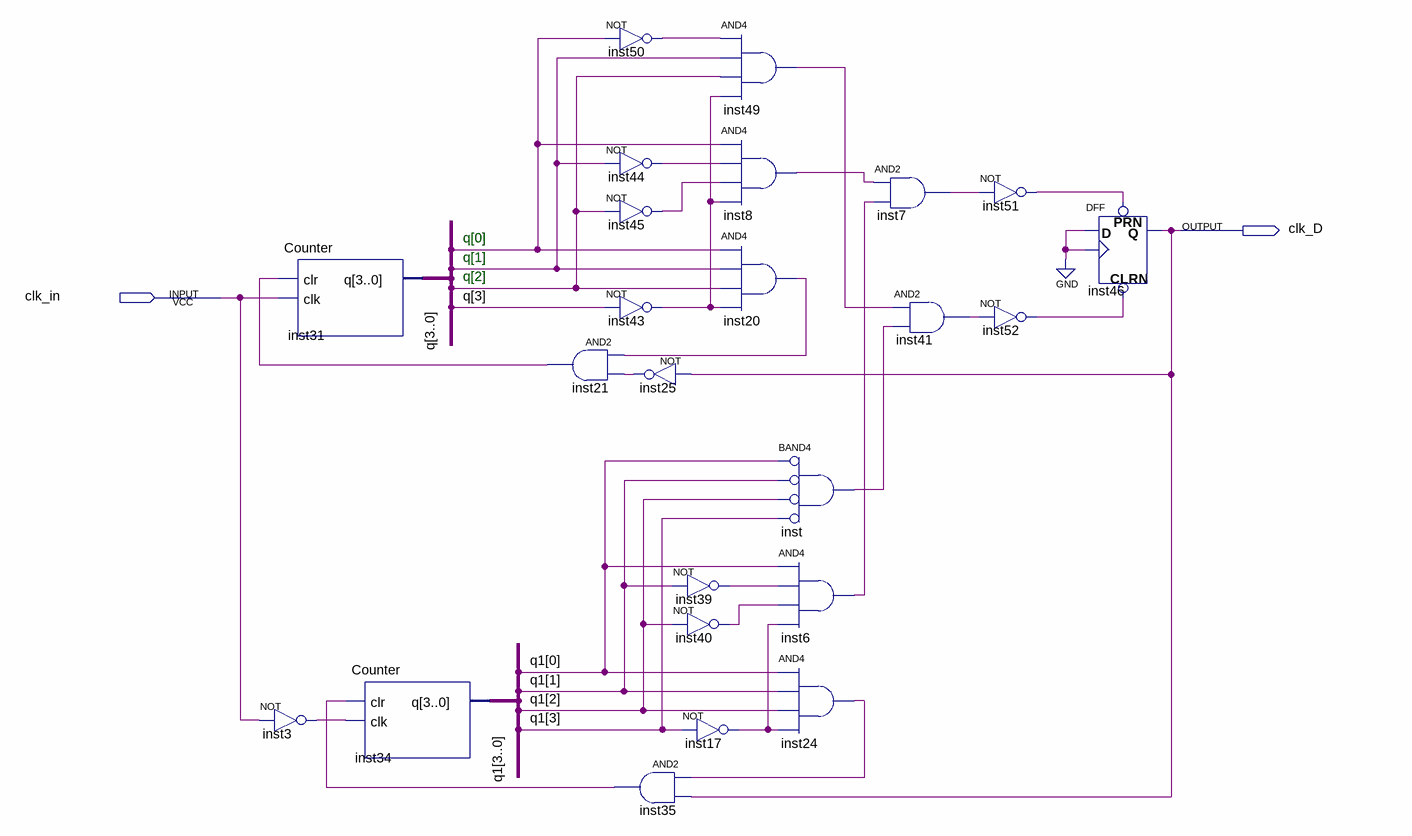
[diagram p0: schematic sheet]
// Quartus schematic Block2.bdf as structural Verilog: 24 symbols, 2 pins
module Block2 (
  input  clk_in,
  output clk_D
);

  wire inst3_out, inst6_out, inst7_out, inst8_out, inst17_out, inst20_out, inst21_out, inst24_out,
       inst25_out, inst35_out, inst39_out, inst40_out, inst41_out, inst43_out, inst44_out, inst45_out,
       inst49_out, inst50_out, inst51_out, inst52_out, inst_out;
  wire [3:0] q, q1;

  Counter inst31 (.clr(inst21_out), .clk(clk_in), .q(q));
  not inst3 (inst3_out, clk_in);
  Counter inst34 (.clr(inst35_out), .clk(inst3_out), .q(q1));
  and inst21 (inst21_out, inst20_out, inst25_out);
  not inst50 (inst50_out, q[0]);
  not inst44 (inst44_out, q[1]);
  not inst45 (inst45_out, q[2]);
  not inst43 (inst43_out, q[3]);
  not inst25 (inst25_out, clk_D);
  and inst35 (inst35_out, inst24_out, clk_D);
  and inst49 (inst49_out, inst50_out, q[1], q[2], inst43_out);
  and inst8 (inst8_out, q[0], inst44_out, inst45_out, inst43_out);
  and inst20 (inst20_out, q[0], q[1], q[2], inst43_out);
  not inst39 (inst39_out, q1[1]);
  not inst40 (inst40_out, q1[2]);
  not inst17 (inst17_out, q1[3]);
  and inst (inst_out, ~q1[0], ~q1[1], ~q1[2], ~q1[3]);  // BAND4
  and inst6 (inst6_out, q1[0], inst39_out, inst40_out, inst17_out);
  and inst24 (inst24_out, q1[0], q1[1], q1[2], inst17_out);
  and inst7 (inst7_out, inst8_out, inst6_out);
  and inst41 (inst41_out, inst49_out, inst_out);
  not inst51 (inst51_out, inst7_out);
  not inst52 (inst52_out, inst41_out);
  DFF inst46 (.CLRN(inst52_out), .CLK(1'b0), .D(1'b0), .PRN(inst51_out), .Q(clk_D));

  // Notes on the sheet:
  //   q[0]
  //   q[1]
  //   q[2]
endmodule
